# EAGLE design gloves (EAGLE 7.7.0)
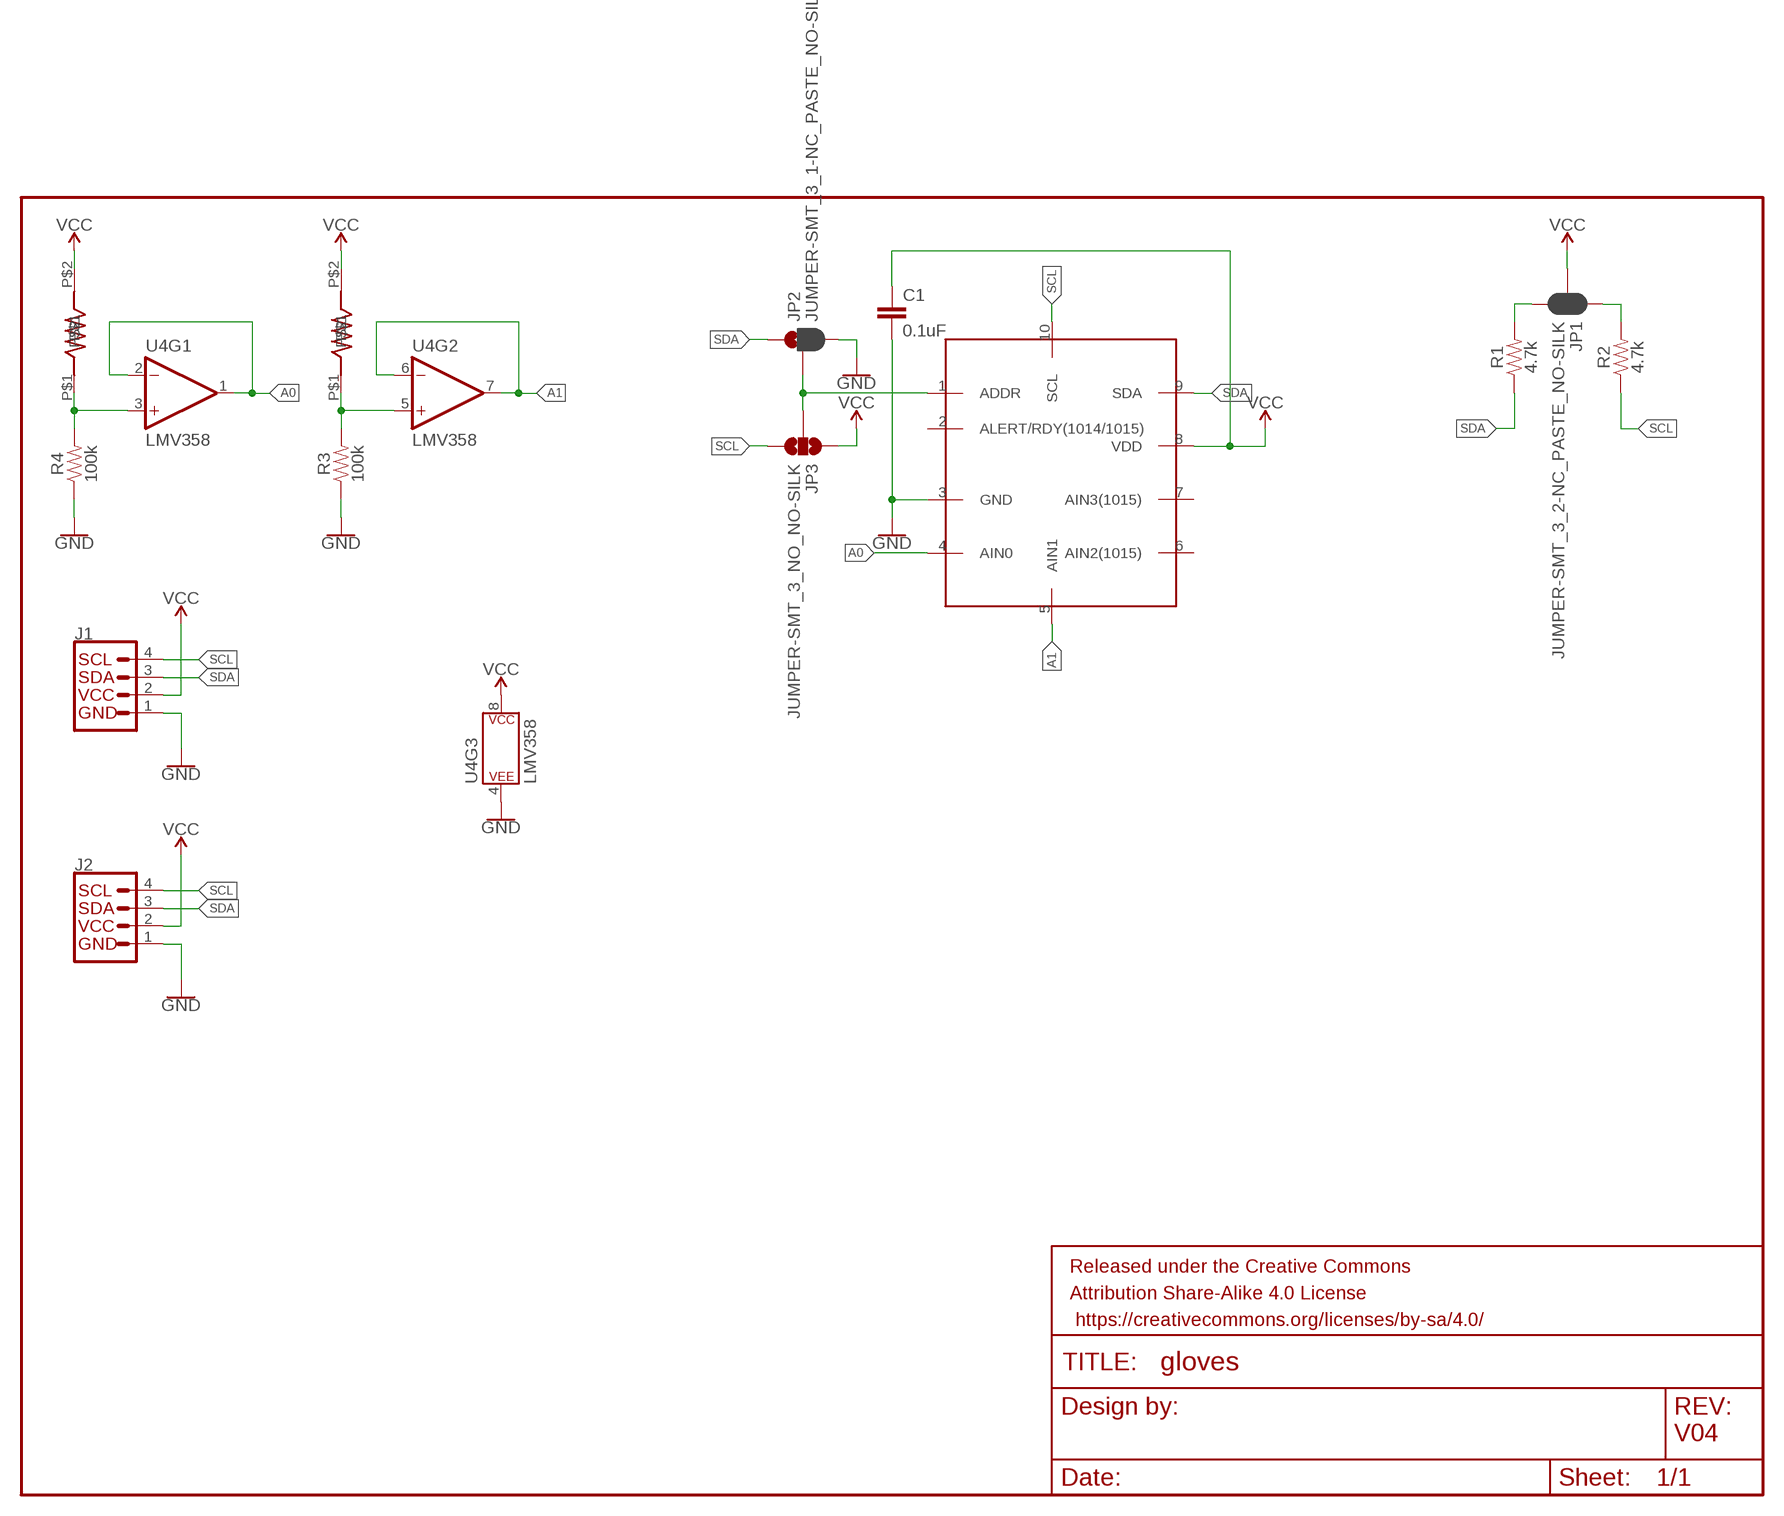
[diagram p0: schematic, sheet 1]

## Parts
C1  0.1uF  0.1UF-0603-25V-(+80/-20%)  [0603]
FRAME1  FRAME-LETTER  [CREATIVE_COMMONS]
J1  QWIIC_CONNECTORJS-1MM  [1X04_1MM_RA]
J2  QWIIC_CONNECTORJS-1MM  [1X04_1MM_RA]
JP1  JUMPER-SMT_3_2-NC_PASTE_NO-SILK  [SMT-JUMPER_3_2-NC_PASTE_NO-SILK]
JP2  JUMPER-SMT_3_1-NC_PASTE_NO-SILK  [SMT-JUMPER_3_1-NC_PASTE_NO-SILK]
JP3  JUMPER-SMT_3_NO_NO-SILK  [SMT-JUMPER_3_NO_NO-SILK]
R1  4.7k  4.7KOHM-0603-1/10W-1%  [0603]
R2  4.7k  4.7KOHM-0603-1/10W-1%  [0603]
R3  100k  100KOHM-0603-1/10W-1%  [0603]
R4  100k  100KOHM-0603-1/10W-1%  [0603]
U4  LMV358  LMV358SOIC  [SO08]
U$1  ADS101X-ADC_TO_I2CADS101X  [MSOP-10-GNDPAD]
U$3  FLEX_SENSOR  [FLEX_SENSOR]
U$4  FLEX_SENSOR  [FLEX_SENSOR]

## Nets
A0: U4.1(OUT) U4.2(-IN) U$1.4(AIN0)
A1: U4.6(-IN) U4.7(OUT) U$1.5(AIN1)
GND: C1.2 J1.1 J2.1 JP2.3 R3.1 R4.1 U4.4(P$V-) U$1.3(GND)
N$1: JP2.2 JP3.2 U$1.1(ADDR)
N$3: R3.2 U4.5(+IN) U$3.P$1
N$4: R4.2 U4.3(+IN) U$4.P$1
N$7: JP1.1 R2.2
N$8: JP1.3 R1.2
SCL: J1.4 J2.4 JP3.3 R2.1 U$1.10(SCL)
SDA: J1.3 J2.3 JP2.1 R1.1 U$1.9(SDA)
VCC: C1.1 J1.2 J2.2 JP1.2 JP3.1 U4.8(P$V+) U$1.8(VDD) U$3.P$2 U$4.P$2
Unconnected: U$1.2(ALERT/RDY(1014/1015)) U$1.6(AIN2(1015)) U$1.7(AIN3(1015))

## Notes on the sheet
- V04

## Library data of the parts
C1 = SparkFun-Capacitors:0.1UF: 0.1µF ceramic capacitors A capacitor is a passive two-terminal electrical component used to store electrical energy temporarily in an electric field.; PROD_ID: CAP-00810
FRAME1 = SparkFun-Aesthetics:FRAME-LETTER: Schematic Frame - Letter Standard 8.5x11 US Letter frame
J1 J2 = SparkFun-Connectors:QWIIC_CONNECTOR: SparkFun I2C Standard Qwiic Connector An SMD 1mm pitch JST connector makes it easy and quick (get it? Qwiic?) to connect I2C devices to each other. The Qwiic system <http://www.sparkfun.com/qwiic> enables fast and solderless connection between popular platforms and various sensors and actuators. We carry 200mm <https://www.sparkfun.com/products/14204>, 100mm <https://www.sparkfun.com/products/14205>, 50mm <https://www.sparkfun.com/products/14206>, and breadboard friendly <https://www.sparkfun.com/products/14207> Qwiic cables. We also offer 10 pcs strips <https://www.sparkfun.com/products/14323> the SMD connectors.; PROD_ID: CONN-13694
JP1 = SparkFun-Jumpers:JUMPER-SMT_3_2-NC_PASTE: Normally closed solder jumper (2 of 2 connections) This jumper has an aperture in the stencil to allow solder paste to bridge both connections. Both connections are normally closed (NC). Wick off the solder to open the connection(s). Reapply solder to reclose the connection(s).
JP2 = SparkFun-Jumpers:JUMPER-SMT_3_1-NC_PASTE: Normally closed solder jumper (1 of 2 connections) This jumper has an aperture in the stencil to allow solder paste to bridge one of the two connections. One connection is normally closed (NC), while the other is normally open (NO). Wick off the solder to open the connection. Reapply solder to reclose the connection. Apply solder to the other side instead to change the current path.
JP3 = SparkFun-Jumpers:JUMPER-SMT_3_NO: Normally open jumper This jumper has three pads in close proximity to each other. Apply solder to close the connection(s).
R1 R2 = SparkFun-Resistors:4.7KOHM: 4.7kΩ resistor A resistor is a passive two-terminal electrical component that implements electrical resistance as a circuit element. Resistors act to reduce current flow, and, at the same time, act to lower voltage levels within circuits. - Wikipedia; PROD_ID: RES-07857
R3 R4 = SparkFun-Resistors:100KOHM: 100kΩ resistor A resistor is a passive two-terminal electrical component that implements electrical resistance as a circuit element. Resistors act to reduce current flow, and, at the same time, act to lower voltage levels within circuits. - Wikipedia; PROD_ID: RES-07828
U4 = SparkFun-IC-Amplifiers:LMV358: IC LMV358 DUAL OP AMP Jellybean rail-to-rail output op-amp SparkFun Products SparkFun PicoBoard <https://www.sparkfun.com/products/11888> (WIG-11888) SparkFun Vernier Interface Shield <https://www.sparkfun.com/products/12858> (DEV-12858) SparkFun Blynk Board - ESP8266 <https://www.sparkfun.com/products/13794> (WRL-13794) SparkFun Digital Sandbox <https://www.sparkfun.com/products/12651> (DEV-12651 RoHS); PROD_ID: IC-09657
U$1 = Andy:ADS101X-ADC_TO_I2C
U$3 U$4 = Andy:FLEX_SENSOR

## Board
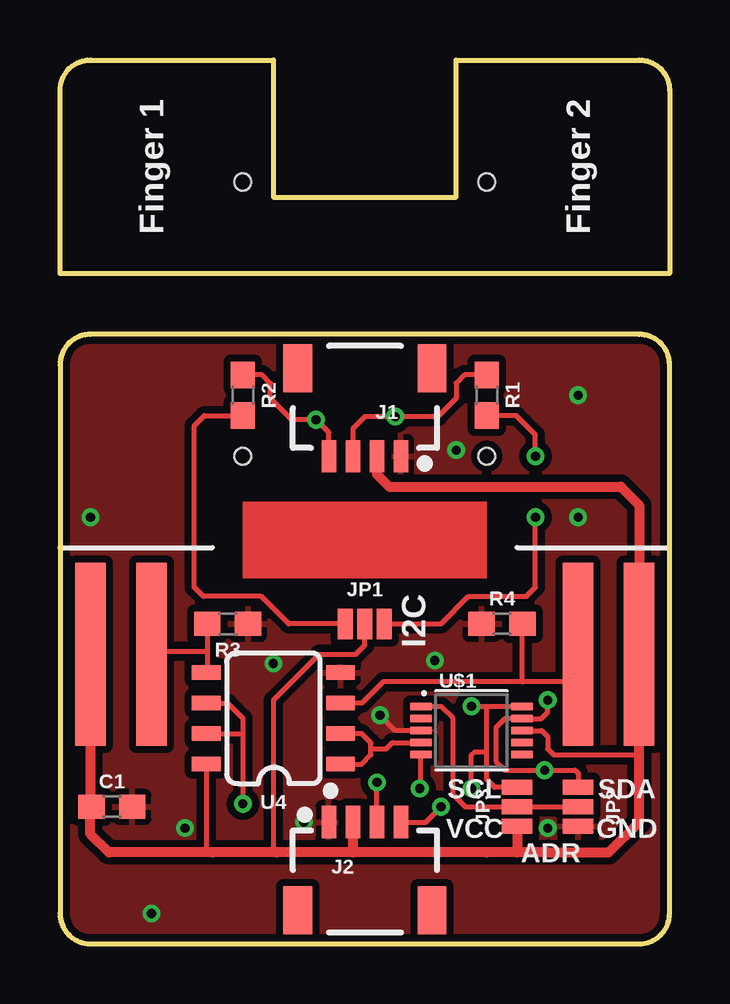
[diagram p1: board, top side]
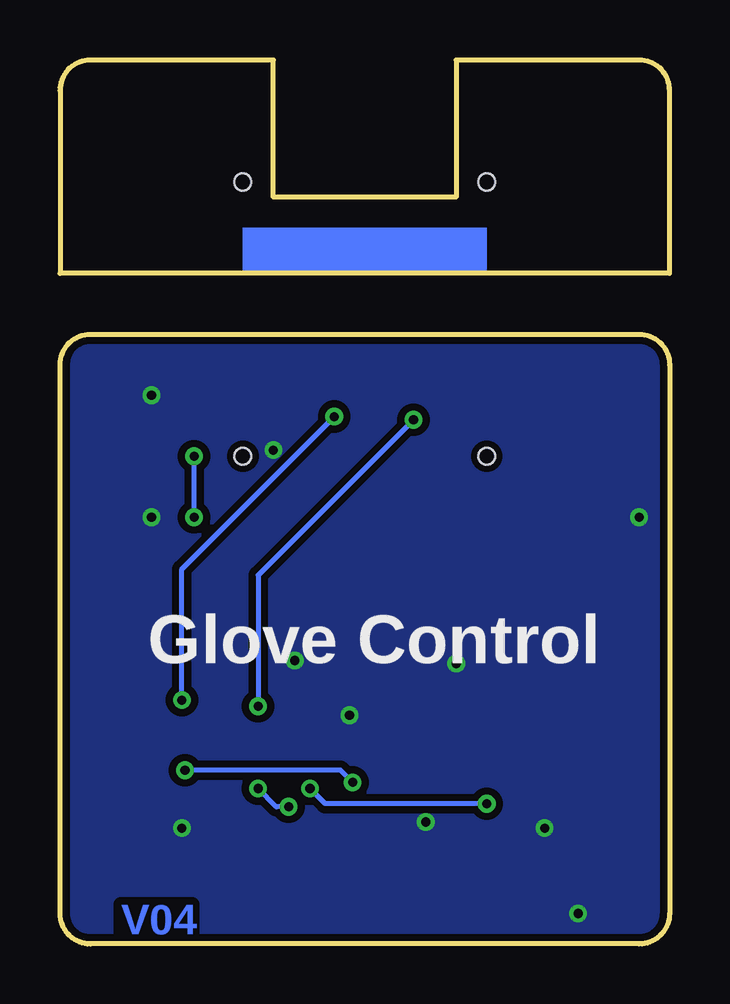
[diagram p2: board, bottom side, seen from below]

Size 25.4 x 36.83 mm. Coordinates in mm from the lower left corner, seen from the top.
Outline: 1.27,0 24.13,0 arc90 25.4,1.27 25.4,24.13 arc90 24.13,25.4 1.27,25.4 arc90 0,24.13 0,1.27 arc90 1.27,0
Outline: 0,27.94 0,35.56 arc-90 1.27,36.83 8.89,36.83 8.89,31.11 16.51,31.11 16.51,36.83 24.13,36.83 arc-90 25.4,35.56 25.4,27.94 0,27.94
Copper layers (1*16): Top 0.035mm / dielectric 1.5mm / Bottom 0.035mm
Design rules "SparkFun-2-layer-TIGHT": minimum track width 7mil, minimum drill 15mil, track to track 7mil, track to pad 7mil, pad to pad 7mil, via to via 7mil, smd to smd 7mil, copper to edge 7mil, drill to drill 7mil, minimum pad ring 7mil, minimum via ring 7mil, stop-mask expansion 4mil, vias tented up to drill 25mil, thermal gap 10mil
Holes 0.7 mm at 7.62,20.32 17.78,20.32 7.62,31.75 17.78,31.75

### Footprints (pad centres in the part's own frame; a part is rotated, then mirrored left to right if it is on the bottom)
0603 = smd 1.1 x 1: 1 -0.85,0; 2 0.85,0
1X04_1MM_RA = smd 0.6 x 1.35: 1 -1.5,0; 2 -0.5,0; 3 0.5,0; 4 1.5,0 | smd 1.2 x 2: NC1 2.8,-3.675; NC2 -2.8,-3.675
SMT-JUMPER_3_2-NC_PASTE_NO-SILK = smd 0.635 x 1.27: 1 -0.813,0; 2 0,0; 3 0.813,0
SMT-JUMPER_3_1-NC_PASTE_NO-SILK = smd 0.635 x 1.27: 1 -0.813,0; 2 0,0; 3 0.813,0
SMT-JUMPER_3_NO_NO-SILK = smd 0.635 x 1.27: 1 -0.813,0; 2 0,0; 3 0.813,0
SO08 = smd 0.6 x 1.2: 1 -1.905,-2.8; 2 -0.635,-2.8; 3 0.635,-2.8; 4 1.905,-2.8; 5 1.905,2.8; 6 0.635,2.8; 7 -0.635,2.8; 8 -1.905,2.8
MSOP-10-GNDPAD = smd 0.305 x 0.889: 1 -1,-2.11; 2 -0.5,-2.11; 3 0,-2.11; 4 0.5,-2.11; 5 1,-2.11; 6 1,2.11; 7 0.5,2.11; 8 0,2.11; 9 -0.5,2.11; 10 -1,2.11
FLEX_SENSOR = smd 1.27 x 7.62: P$1 -1.27,0; P$2 1.27,0

### Placement (x,y rotation side)
C1  2.16,5.71 0 top
FRAME1  -11.43,-10.16 0 top  (outside the outline)
J1  12.7,20.32 180 top
J2  12.7,5.08 0 top
JP1  12.7,13.34 0 top
JP2  21.59,5.71 270 top
JP3  19.05,5.71 90 top
R1  17.78,22.86 270 top
R2  7.62,22.86 270 top
R3  6.99,13.34 180 top
R4  18.41,13.34 0 top
U4  8.89,9.4 90 top
U$1  17.14,8.89 270 top
U$3  2.54,12.06 180 top
U$4  22.86,12.06 0 top

### Tracks (layer width: path | path; a pad name or v marks a point on that pad's centre or on a via)
A0
  Top 0.203: U4.1 12.57,7.49 12.95,7.87 12.95,8.13 | 12.95,8.13 12.95,8.38 12.57,8.76 U4.2 | 12.95,8.13 13.59,8.13 13.85,8.39 U$1.4
A1  (via drill 0.38)
  Top 0.203: 7.62,8.76 7.62,9.4 6.99,10.03 U4.6 | 7.62,8.76 v7.62,5.84 | U4.7 7.62,8.76 | v14.99,6.48 15.04,6.53 U$1.5
  Bottom 0.203: v7.62,5.84 14.35,5.84 v14.99,6.48
GND  (via drill 0.38)
  Top 0.203: U$1.3 13.97,8.89 v13.34,9.53
  other vias: 8.89,11.68 10.16,5.08 15.62,11.81 5.21,4.83 1.27,17.78 21.59,17.78 20.32,4.83 21.59,22.86 16.51,20.57 3.81,1.27
  pour Bottom (isolate 0.305): 0,1.27 arc90 1.27,0 24.13,0 arc90 25.4,1.27 25.4,24.13 arc90 24.13,25.4 1.27,25.4 arc90 0,24.13
  pour Top (isolate 0.305): 25.4,1.27 arc-90 24.13,0 1.27,0 arc-90 0,1.27 0,24.13 arc-90 1.27,25.4 24.13,25.4 arc-90 25.4,24.13
N$1
  Top 0.203: JP2.2 JP3.2 16.89,5.71 16.38,6.22 16.38,9.4 15.89,9.89 U$1.1
N$3
  Top 0.203: R3.2 6.13,12.19 | 6.13,12.19 6.13,11.35 U4.5 | U$3.P$1 3.81,12.19 6.13,12.19
N$4
  Top 0.203: 19.27,10.92 R4.2 | 19.27,10.92 13.46,10.92 12.57,10.03 U4.3 | U$4.P$1 21.59,10.92 19.27,10.92
N$7
  Top 0.203: JP1.1 9.53,13.34 8.38,14.48 5.97,14.48 5.59,14.86 5.59,21.59 6.01,22.01 R2.2
N$8  (via drill 0.38)
  Top 0.203: JP1.3 15.88,13.34 17.02,14.48 19.43,14.48 19.81,14.86 v19.81,17.78 | v19.81,20.32 19.81,21.21 19.01,22.01 R1.2
  Bottom 0.203: v19.81,17.78 v19.81,20.32
SCL  (via drill 0.38)
  Top 0.203: JP3.3 18.11,6.53 17.78,6.86 17.78,8 | 17.78,8 17.78,9.89 | J2.4 15.24,5.08 v15.88,5.71 | v17.14,6.48 17.14,7.87 17.27,8 17.78,8 | J1.4 11.2,21.31 v10.67,21.84 9.65,21.84 8.76,22.73 8.76,23.37 8.42,23.71 R2.1 | U$1.10 17.78,9.89 | 17.78,9.89 17.16,9.89 v17.14,9.91
  Bottom 0.203: v15.88,5.71 16.38,5.71 v17.14,6.48 | v10.67,21.84 17.14,15.37 v17.14,9.91
SDA  (via drill 0.38)
  Top 0.203: R1.1 16.85,23.71 16.51,23.37 16.51,22.73 15.75,21.97 v13.97,21.97 12.7,21.97 12.2,21.47 J1.3 | JP2.1 21.59,7.11 21.46,7.24 v20.19,7.24 18.54,7.24 18.16,7.62 18.16,9.02 18.53,9.39 U$1.9 20.06,9.39 20.32,9.65 v20.32,10.16 | J2.3 v13.2,6.72 v13.21,6.73
  Bottom 0.203: v13.21,6.73 13.72,7.24 v20.19,7.24 | v20.32,10.16 20.32,15.62 v13.97,21.97
VCC
  Top 0.203: 20.32,3.94 20.19,3.81 | 9.02,3.81 8.89,3.94 8.89,10.16 10.79,12.06 12.32,12.06 12.7,12.45 JP1.2 | 18.29,3.81 17.78,3.81 | U$1.8 20.07,8.89 20.32,8.64 20.32,8.13 20.57,7.87 24.13,7.87 | U4.8 6.09,3.81 6.35,3.81
  Top 0.406: 19.05,3.81 20.19,3.81 22.86,3.81 24.13,5.08 24.13,7.87 U$4.P$2 24.13,18.29 23.37,19.05 13.72,19.05 13.2,19.57 J1.2 | 19.05,3.81 17.78,3.81 12.2,3.81 | 12.2,3.81 9.02,3.81 6.35,3.81 2.03,3.81 1.27,4.57 1.27,5.68 C1.1 1.27,5.75 U$3.P$2 | J2.2 12.2,3.81 | JP3.1 19.05,3.81
(copper drawn outside any net)
  shapes: Bottom area x1, Top area x1

### Text on the board
Bottom: V04
tPlace: Finger 1 | Finger 2 | I2C | SCL | SDA | VCC | GND | ADR
bPlace: Glove Control
tDocu: Andy England